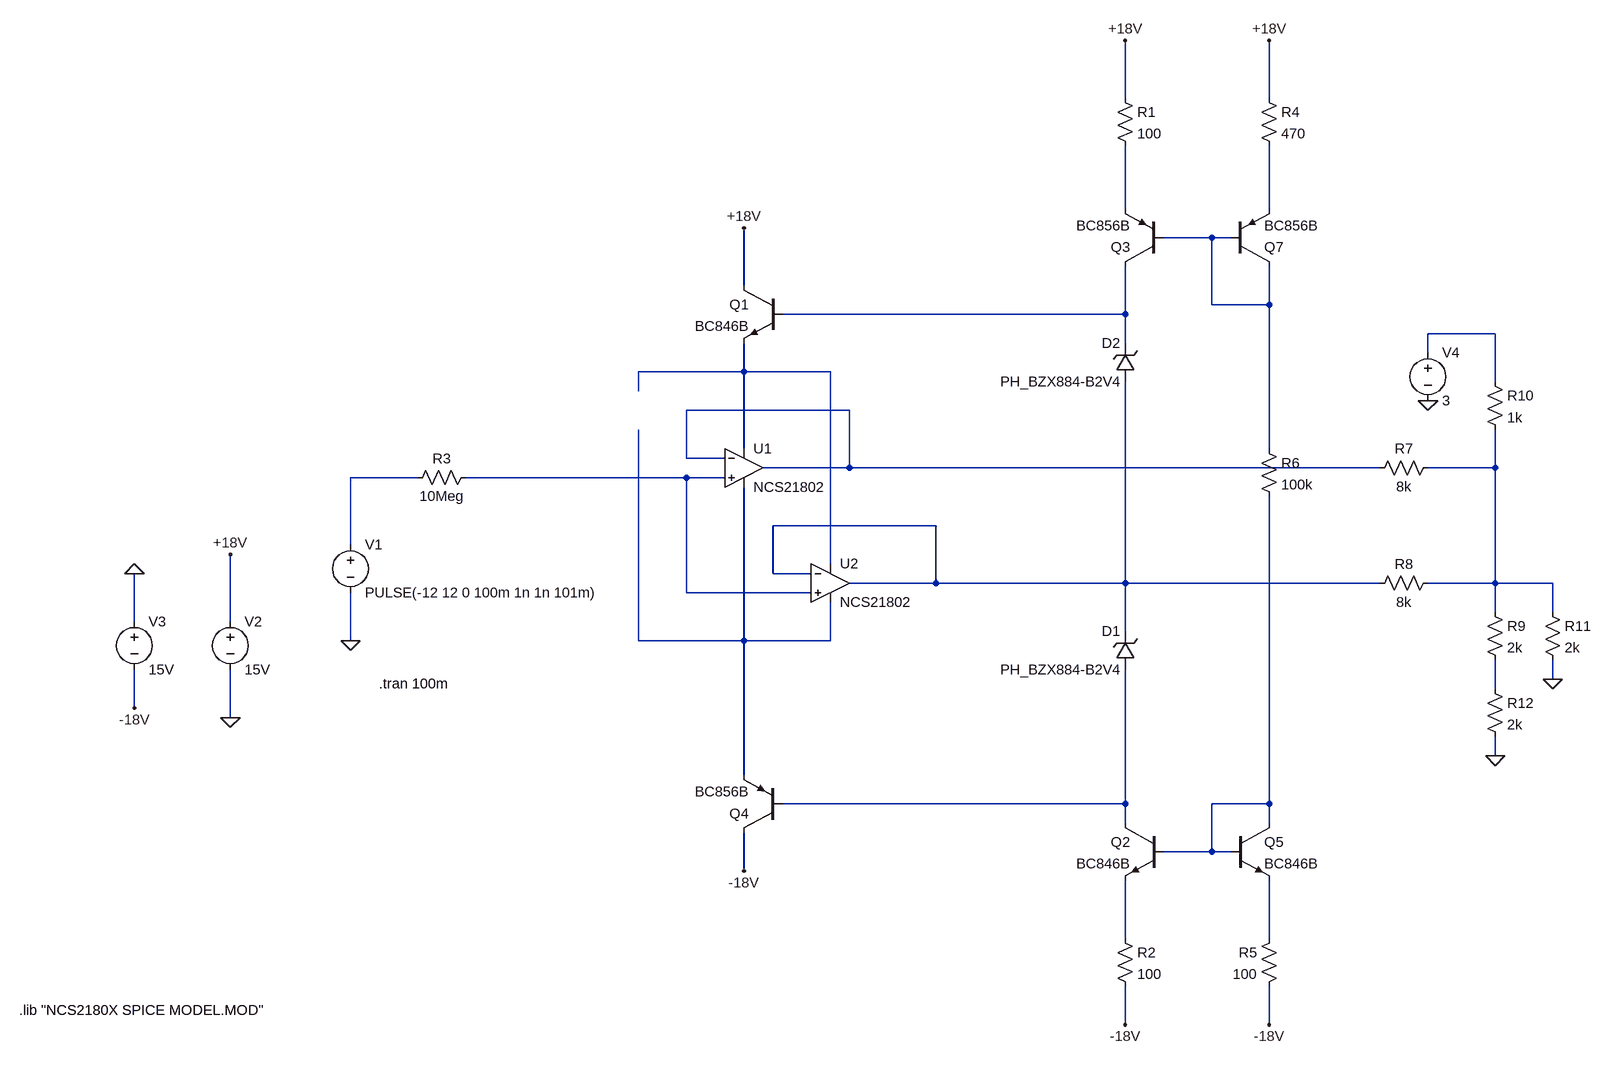
[diagram p0: schematic 002_bootstrapped_input_buffer.asc]
002_bootstrapped_input_buffer.asc, the LTspice schematic file:
Version 4
SHEET 1 2884 680
WIRE 2000 -1200 2000 -1296
WIRE 2240 -1200 2240 -1296
WIRE 2000 -992 2000 -1120
WIRE 2240 -992 2240 -1120
WIRE 2144 -944 2064 -944
WIRE 2176 -944 2144 -944
WIRE 1136 -864 1136 -960
WIRE 2144 -832 2144 -944
WIRE 2240 -832 2240 -896
WIRE 2240 -832 2144 -832
WIRE 2000 -816 2000 -896
WIRE 2000 -816 1200 -816
WIRE 2720 -784 2608 -784
WIRE 2000 -768 2000 -816
WIRE 2608 -752 2608 -784
WIRE 1136 -720 1136 -768
WIRE 1136 -720 960 -720
WIRE 1280 -720 1136 -720
WIRE 2720 -704 2720 -784
WIRE 960 -688 960 -720
WIRE 1312 -656 1040 -656
WIRE 1136 -592 1136 -720
WIRE 2240 -592 2240 -832
WIRE 1040 -576 1040 -656
WIRE 1104 -576 1040 -576
WIRE 1312 -560 1312 -656
WIRE 1312 -560 1168 -560
WIRE 2528 -560 1312 -560
WIRE 2720 -560 2720 -624
WIRE 2720 -560 2608 -560
WIRE 592 -544 480 -544
WIRE 1040 -544 672 -544
WIRE 1104 -544 1040 -544
WIRE 1456 -464 1184 -464
WIRE 480 -432 480 -544
WIRE 1280 -400 1280 -720
WIRE 1184 -384 1184 -464
WIRE 1248 -384 1184 -384
WIRE 1456 -368 1456 -464
WIRE 1456 -368 1312 -368
WIRE 2000 -368 2000 -704
WIRE 2000 -368 1456 -368
WIRE 2528 -368 2000 -368
WIRE 2720 -368 2720 -560
WIRE 2720 -368 2608 -368
WIRE 2816 -368 2720 -368
WIRE 1040 -352 1040 -544
WIRE 1248 -352 1040 -352
WIRE 2720 -320 2720 -368
WIRE 2816 -320 2816 -368
WIRE -352 -304 -352 -384
WIRE -192 -304 -192 -416
WIRE 2000 -288 2000 -368
WIRE 480 -272 480 -352
WIRE 960 -272 960 -624
WIRE 1136 -272 1136 -528
WIRE 1136 -272 960 -272
WIRE 1280 -272 1280 -336
WIRE 1280 -272 1136 -272
WIRE 2816 -208 2816 -240
WIRE 2720 -192 2720 -240
WIRE -352 -160 -352 -224
WIRE -192 -144 -192 -224
WIRE 2720 -80 2720 -112
WIRE 1136 -48 1136 -272
WIRE 2000 0 2000 -224
WIRE 2000 0 1200 0
WIRE 2240 0 2240 -512
WIRE 2240 0 2144 0
WIRE 2000 32 2000 0
WIRE 2240 32 2240 0
WIRE 2144 80 2144 0
WIRE 2144 80 2064 80
WIRE 2176 80 2144 80
WIRE 1136 112 1136 48
WIRE 2000 224 2000 128
WIRE 2240 224 2240 128
WIRE 2000 368 2000 304
WIRE 2240 368 2240 304
FLAG 480 -272 0
FLAG -192 -416 +18V
FLAG -192 -144 0
FLAG -352 -160 -18V
FLAG -352 -384 0
FLAG 1136 -960 +18V
FLAG 1136 112 -18V
FLAG 2000 -1296 +18V
FLAG 2000 368 -18V
FLAG 2240 -1296 +18V
FLAG 2240 368 -18V
FLAG 2720 -80 0
FLAG 2608 -672 0
FLAG 2816 -208 0
SYMBOL res 688 -560 R90
WINDOW 0 0 56 VBottom 2
WINDOW 3 32 56 VTop 2
SYMATTR InstName R3
SYMATTR Value 10Meg
SYMBOL voltage 480 -448 R0
WINDOW 123 0 0 Left 0
WINDOW 39 0 0 Left 0
SYMATTR InstName V1
SYMATTR Value PULSE(-12 12 0 100m 1n 1n 101m)
SYMBOL voltage -192 -320 R0
WINDOW 123 0 0 Left 0
WINDOW 39 0 0 Left 0
SYMATTR InstName V2
SYMATTR Value 15V
SYMBOL OpAmps\\opamp2 1136 -624 R0
SYMATTR InstName U1
SYMATTR Value NCS21802
SYMBOL voltage -352 -320 R0
WINDOW 123 0 0 Left 0
WINDOW 39 0 0 Left 0
SYMATTR InstName V3
SYMATTR Value 15V
SYMBOL npn 1200 -864 M0
SYMATTR InstName Q1
SYMATTR Value BC846B
SYMBOL zener 2016 -224 R180
WINDOW 0 24 64 Left 2
WINDOW 3 24 0 Left 2
SYMATTR InstName D1
SYMATTR Value PH_BZX884-B2V4
SYMATTR Description Diode
SYMATTR Type diode
SYMBOL res 1984 -1216 R0
SYMATTR InstName R1
SYMATTR Value 100
SYMBOL res 1984 208 R0
SYMATTR InstName R2
SYMATTR Value 100
SYMBOL pnp 2064 -896 R180
SYMATTR InstName Q3
SYMATTR Value BC856B
SYMBOL res 2224 -1216 R0
SYMATTR InstName R4
SYMATTR Value 470
SYMBOL res 2256 208 M0
SYMATTR InstName R5
SYMATTR Value 100
SYMBOL res 2224 -608 R0
SYMATTR InstName R6
SYMATTR Value 100k
SYMBOL pnp 1200 48 R180
SYMATTR InstName Q4
SYMATTR Value BC856B
SYMBOL pnp 2176 -896 M180
SYMATTR InstName Q7
SYMATTR Value BC856B
SYMBOL npn 2064 32 M0
SYMATTR InstName Q2
SYMATTR Value BC846B
SYMBOL npn 2176 32 R0
SYMATTR InstName Q5
SYMATTR Value BC846B
SYMBOL res 2624 -576 R90
WINDOW 0 0 56 VBottom 2
WINDOW 3 32 56 VTop 2
SYMATTR InstName R7
SYMATTR Value 8k
SYMBOL OpAmps\\opamp2 1280 -432 R0
SYMATTR InstName U2
SYMATTR Value NCS21802
SYMBOL res 2624 -384 R90
WINDOW 0 0 56 VBottom 2
WINDOW 3 32 56 VTop 2
SYMATTR InstName R8
SYMATTR Value 8k
SYMBOL res 2704 -336 R0
SYMATTR InstName R9
SYMATTR Value 2k
SYMBOL res 2704 -720 R0
SYMATTR InstName R10
SYMATTR Value 1k
SYMBOL res 2800 -336 R0
SYMATTR InstName R11
SYMATTR Value 2k
SYMBOL res 2704 -208 R0
SYMATTR InstName R12
SYMATTR Value 2k
SYMBOL voltage 2608 -768 R0
WINDOW 123 0 0 Left 0
WINDOW 39 0 0 Left 0
SYMATTR InstName V4
SYMATTR Value 3
SYMBOL zener 2016 -704 R180
WINDOW 0 24 64 Left 2
WINDOW 3 24 0 Left 2
SYMATTR InstName D2
SYMATTR Value PH_BZX884-B2V4
SYMATTR Description Diode
SYMATTR Type diode
TEXT 528 -200 Left 2 !.tran 100m
TEXT -544 344 Left 2 !.lib "NCS2180X SPICE MODEL.MOD"

The netlist it stands for:
* 002_bootstrapped_input_buffer.asc
R3 N010 N009 10Meg
V1 N009 0 PULSE(-12 12 0 100m 1n 1n 101m)
V2 +18V 0 15V
XU1 N010 N007 N006 N012 N007 NCS21802  ; pins In+ In- V+ V- OUT
V3 0 -18V 15V
Q1 +18V N004 N006 0 BC846B
D1 N014 N011 PH_BZX884-B2V4
R1 +18V N001 100
R2 N016 -18V 100
Q3 N004 N003 N001 0 BC856B
R4 +18V N002 470
R5 N017 -18V 100
R6 N003 N015 100k
Q4 -18V N014 N012 0 BC856B
Q7 N003 N003 N002 0 BC856B
Q2 N014 N015 N016 0 BC846B
Q5 N015 N015 N017 0 BC846B
R7 N008 N007 8k
XU2 N010 N011 N006 N012 N011 NCS21802  ; pins In+ In- V+ V- OUT
R8 N008 N011 8k
R9 N008 N013 2k
R10 N005 N008 1k
R11 N008 0 2k
R12 N013 0 2k
V4 N005 0 3
D2 N011 N004 PH_BZX884-B2V4
.model D D
.lib standard.dio
.model NPN NPN
.model PNP PNP
.lib standard.bjt
.tran 100m
.lib "NCS2180X SPICE MODEL.MOD"
.backanno
.end